# Altium project USB_receiver.PrjPcb
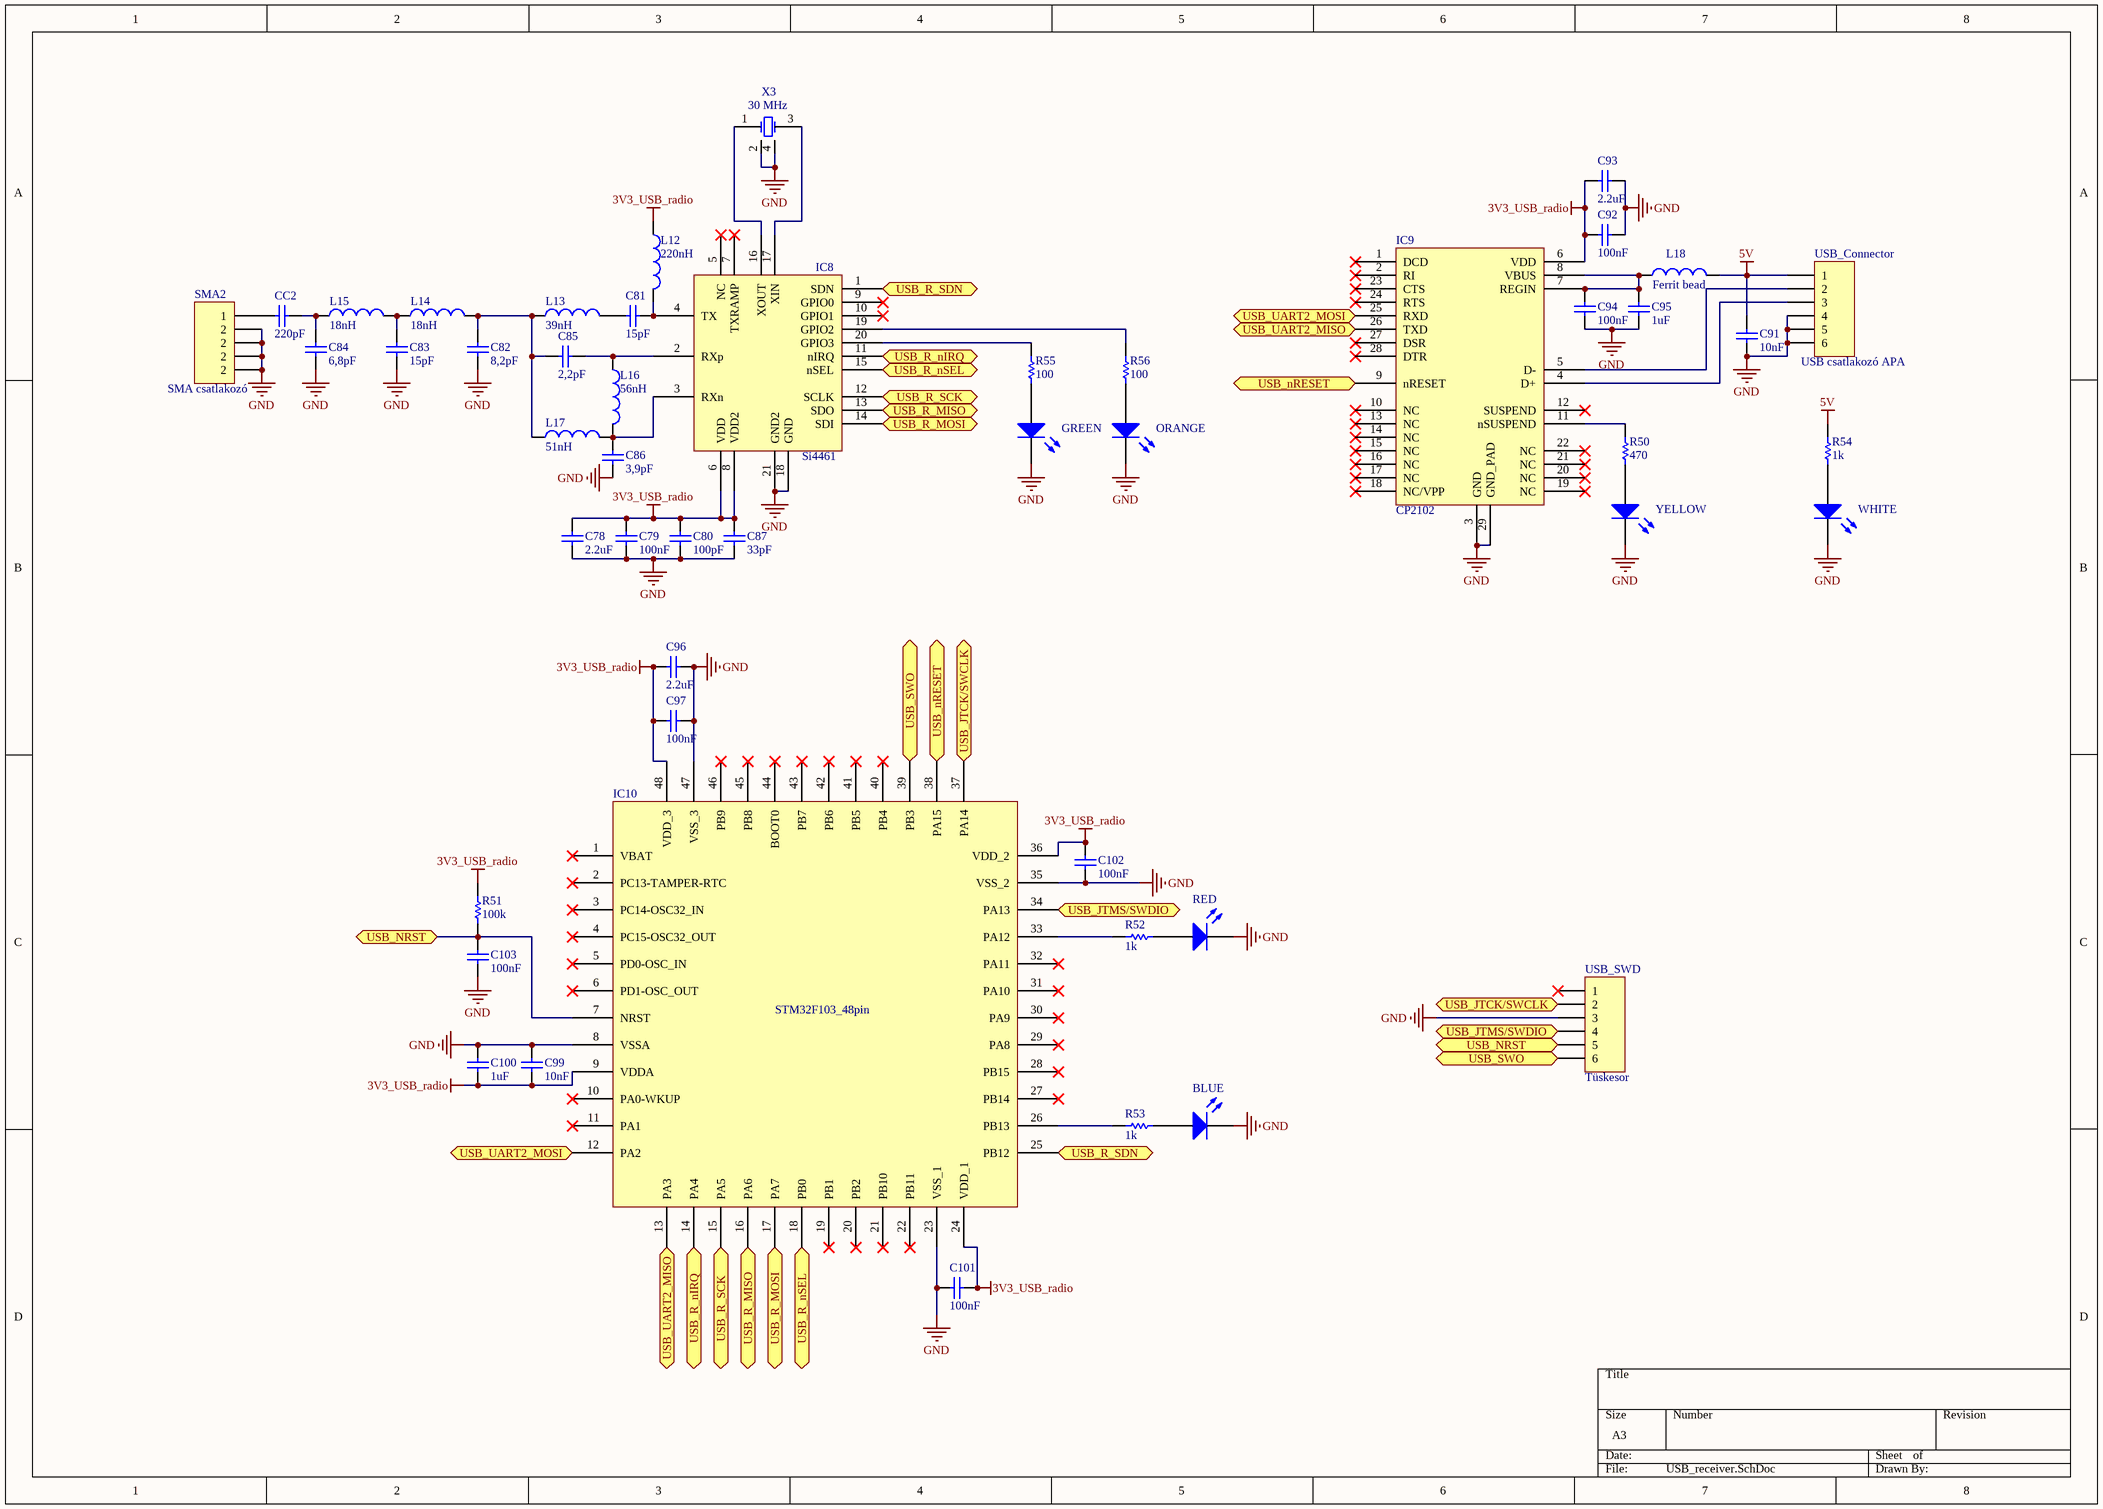
[diagram p0: USB_receiver.SchDoc]
1 sheet, 50 parts. Net scope: flat (ports and power ports of the same name join across sheets).
Board file: USB_receiver.PcbDoc

## Sheet USB_receiver.SchDoc
size A3; PageSetup: Record=PageOptions|CenterHorizontal=True|CenterVertical=True|PrintScale=0.73|XCorrection=1.00|YCorrection=1.00|PrintKind=0|BorderSize=5000000|LeftOffset=0|BottomOffset=0|Orientation=2|PaperLength=1000|PaperWidth=1000|Scale=100|PaperSource=7|PrintQuality=-3|MediaType=1|DitherType=10|PrintScaleMode=1|PaperKind=A4|PaperIndex=9

### Parts
BLUE  RED  [1608[0603]]  (value not drawn)
C78  value 2.2uF  [0402]  (hidden comment: Cap)
C79  value 100nF  [0402]  (hidden comment: Cap)
C80  value 100pF  [0402]  (hidden comment: Cap)
C81  value 15pF  [0402]  (hidden comment: Cap)
C82  value 8,2pF  [0402]  (hidden comment: Cap)
C83  value 15pF  [0402]  (hidden comment: Cap)
C84  value 6,8pF  [0402]  (hidden comment: Cap)
C85  value 2,2pF  [0402]  (hidden comment: Cap)
C86  value 3,9pF  [0402]  (hidden comment: Cap)
C87  value 33pF  [0402]  (hidden comment: Cap)
C91  value 10nF  [0402]  (hidden comment: Cap)
C92  value 100nF  [0402]  (hidden comment: Cap)
C93  value 2.2uF  [0402]  (hidden comment: Cap)
C94  value 100nF  [0402]  (hidden comment: Cap)
C95  value 1uF  [0402]  (hidden comment: Cap)
C96  value 2.2uF  [0402]  (hidden comment: Cap)
C97  value 100nF  [0402]  (hidden comment: Cap)
C99  value 10nF  [0402]  (hidden comment: Cap)
C100  value 1uF  [0402]  (hidden comment: Cap)
C101  value 100nF  [0402]  (hidden comment: Cap)
C102  value 100nF  [0402]  (hidden comment: Cap)
C103  value 100nF  [0402]  (hidden comment: Cap)
CC2  value 220pF  [0402]  (hidden comment: Cap)
GREEN  RED  [1608[0603]]  (value not drawn)
IC8  Si4461  [QFN20_thermal_pad]
IC9  CP2102  [RHD28_M]
IC10  STM32F103_48pin  [LQFP48]
L12  value 220nH  [0402]  (hidden comment: Inductor)
L13  value 39nH  [0402]  (hidden comment: Inductor)
L14  value 18nH  [0402]  (hidden comment: Inductor)
L15  value 18nH  [0402]  (hidden comment: Inductor)
L16  value 56nH  [0402]  (hidden comment: Inductor)
L17  value 51nH  [0402]  (hidden comment: Inductor)
L18  Ferrit bead  [1608[0603]]
ORANGE  RED  [1608[0603]]  (value not drawn)
R50  value 470  [0402]  (hidden comment: Res1)
R51  value 100k  [0402]  (hidden comment: Res1)
R52  value 1k  [0402]  (hidden comment: Res1)
R53  value 1k  [0402]  (hidden comment: Res1)
R54  value 1k  [0402]  (hidden comment: Res1)
R55  value 100  [0402]  (hidden comment: Res1)
R56  value 100  [0402]  (hidden comment: Res1)
RED  RED  [1608[0603]]  (value not drawn)
SMA2  SMA csatlakozó  [SMA_connector]
USB_Connector  USB csatlakozó APA  [USB_APA_SMD]
USB_SWD  Tüskesor  [HDR1X6]
WHITE  RED  [1608[0603]]  (value not drawn)
X3  30 MHz  [crystal_sx2520]
YELLOW  RED  [1608[0603]]  (value not drawn)

### Ports
USB_JTCK/SWCLK (bidir), USB_JTMS/SWDIO (bidir), USB_nRESET (in), USB_nRESET (out), USB_NRST, USB_R_MISO (in), USB_R_MISO (out), USB_R_MOSI (in), USB_R_MOSI (out), USB_R_nIRQ (in), USB_R_nIRQ (out), USB_R_nSEL (in), USB_R_nSEL (out), USB_R_SCK (in), USB_R_SCK (out), USB_R_SDN (in), USB_R_SDN (out), USB_SWO (bidir), USB_UART2_MISO (in), USB_UART2_MISO (out), USB_UART2_MOSI (in), USB_UART2_MOSI (out)

### Nets
3V3_USB_radio: C78.2 C79.2 C80.2 C87.2 C92.1 C93.1 C96.1 C97.1 C99.1 C100.1 C101.1 C102.1 IC8.6(VDD) IC8.8(VDD2) IC9.6(VDD) IC10.9(VDDA) IC10.24(VDD_1) IC10.36(VDD_2) IC10.48(VDD_3) L12.1 R51.1
5V: C91.2 L18.2 R54.2 USB_Connector.1
GND: BLUE.2(K) C78.1 C79.1 C80.1 C82.2 C83.2 C84.2 C86.1 C87.1 C91.1 C92.2 C93.2 C94.1 C95.1 C96.2 C97.2 C99.2 C100.2 C101.2 C102.2 C103.1 GREEN.2(K) IC8.18(GND) IC8.21(GND2) IC9.3(GND) IC9.29(GND_PAD) IC10.8(VSSA) IC10.23(VSS_1) IC10.35(VSS_2) IC10.47(VSS_3) ORANGE.2(K) RED.2(K) SMA2.2 USB_Connector.4 USB_Connector.5 USB_Connector.6 USB_SWD.3 WHITE.2(K) X3.2(OSC2) X3.4 YELLOW.2(K)
NetBLUE_1: BLUE.1(A) R53.1
NetC81_1: C81.1 IC8.4(TX) L12.2
NetC81_2: C81.2 L13.2
NetC82_1: C82.1 C85.1 L13.1 L14.2 L17.1
NetC83_1: C83.1 L14.1 L15.2
NetC84_1: C84.1 CC2.2 L15.1
NetC85_2: C85.2 IC8.2(RXp) L16.1
NetC86_2: C86.2 IC8.3(RXn) L16.2 L17.2
NetC94_2: C94.2 C95.2 IC9.7(REGIN) IC9.8(VBUS) L18.1
NetC103_2: C103.2 IC10.7(NRST) R51.2 USB_SWD.5 ; port USB_NRST
NetCC2_1: CC2.1 SMA2.1
NetGREEN_1: GREEN.1(A) R55.1
NetIC8_1: IC8.1(SDN) IC10.25(PB12) ; port USB_R_SDN
NetIC8_11: IC8.11(nIRQ) IC10.14(PA4) ; port USB_R_nIRQ
NetIC8_12: IC8.12(SCLK) IC10.15(PA5) ; port USB_R_SCK
NetIC8_13: IC8.13(SDO) IC10.16(PA6) ; port USB_R_MISO
NetIC8_14: IC8.14(SDI) IC10.17(PA7) ; port USB_R_MOSI
NetIC8_15: IC8.15(nSEL) IC10.18(PB0) ; port USB_R_nSEL
NetIC8_16: IC8.16(XOUT) X3.1(OSC1)
NetIC8_17: IC8.17(XIN) X3.3
NetIC8_19: IC8.19(GPIO2) R56.2
NetIC8_20: IC8.20(GPIO3) R55.2
NetIC9_4: IC9.4(D+) USB_Connector.3
NetIC9_5: IC9.5(D-) USB_Connector.2
NetIC9_9: IC9.9(nRESET) IC10.38(PA15) ; port USB_nRESET
NetIC9_11: IC9.11(nSUSPEND) R50.2
NetIC9_25: IC9.25(RXD) IC10.12(PA2) ; port USB_UART2_MOSI
NetIC9_26: IC9.26(TXD) IC10.13(PA3) ; port USB_UART2_MISO
NetIC10_26: IC10.26(PB13) R53.2
NetIC10_33: IC10.33(PA12) R52.2
NetIC10_34: IC10.34(PA13) USB_SWD.4 ; port USB_JTMS/SWDIO
NetIC10_37: IC10.37(PA14) USB_SWD.2 ; port USB_JTCK/SWCLK
NetIC10_39: IC10.39(PB3) USB_SWD.6 ; port USB_SWO
NetORANGE_1: ORANGE.1(A) R56.1
NetR50_1: R50.1 YELLOW.1(A)
NetR52_1: R52.1 RED.1(A)
NetR54_1: R54.1 WHITE.1(A)

Not connected (* = marked no-connect by the designer): IC8 5(NC)* 7(TXRAMP)* 9(GPIO0)* 10(GPIO1)*; IC9 1(DCD)* 2(RI)* 10(NC)* 12(SUSPEND)* 13(NC)* 14(NC)* 15(NC)* 16(NC)* 17(NC)* 18(NC/VPP)* 19(NC)* 20(NC)* 21(NC)* 22(NC)* 23(CTS)* 24(RTS)* 27(DSR)* 28(DTR)*; IC10 1(VBAT)* 2(PC13-TAMPER-RTC)* 3(PC14-OSC32_IN)* 4(PC15-OSC32_OUT)* 5(PD0-OSC_IN)* 6(PD1-OSC_OUT)* 10(PA0-WKUP)* 11(PA1)* 19(PB1)* 20(PB2)* 21(PB10)* 22(PB11)* 27(PB14)* 28(PB15)* 29(PA8)* 30(PA9)* 31(PA10)* 32(PA11)* 40(PB4)* 41(PB5)* 42(PB6)* 43(PB7)* 44(BOOT0)* 45(PB8)* 46(PB9)*; USB_SWD 1*

### Library data of the parts
BLUE GREEN ORANGE RED WHITE YELLOW = LED0: Typical INFRARED GaAs LED; Published: 8-Jun-2000; LatestRevisionDate: 08-Jul-2005; LatestRevisionNote: Mech Layer 1 removed.; PackageReference: LED-0; Publisher: Altium Limited; PackageDescription: LED; 2 Leads
C78-C87 C91-C97 C99-C103 CC2 = Cap: Capacitor; Published: 8-Jun-2000; LatestRevisionDate: 17-Jul-2002; LatestRevisionNote: Re-released for DXP Platform.; PackageReference: RAD-0.3; Publisher: Altium Limited; PackageDescription: Radial Cap, Thru-Hole; 2 Leads; 0.3 in Pin Spacing
L12-L17 = Inductor: Code_IEC: 1005; Published: 8-Jun-2000; LatestRevisionDate: 29-May-2009; LatestRevisionNote: IPC-7351 Footprint Added.; PackageReference: 0402-A; Publisher: Altium Limited; PackageDescription: Chip Inductor; Code_JEITA: 0402
L18 = Inductor: Code_IEC: 1005; Value: 600Ohm/100MHz-2A; Published: 8-Jun-2000; LatestRevisionDate: 29-May-2009; LatestRevisionNote: IPC-7351 Footprint Added.; PackageReference: 0402-A; Publisher: Altium Limited; PackageDescription: Chip Inductor; Code_JEITA: 0402
R50-R56 = Res1: Resistor; Published: 8-Jun-2000; LatestRevisionDate: 17-Jul-2002; LatestRevisionNote: Re-released for DXP Platform.; PackageReference: AXIAL-0.3; Publisher: Altium Limited; PackageDescription: Axial Device, Thru-Hole; 2 Leads; 0.3 in Pin Spacing
SMA2 = Header 5: Header, 5-Pin; LatestRevisionDate: 17-Jul-2002; LatestRevisionNote: Re-released for DXP Platform.; Publisher: Altium Limited
USB_Connector USB_SWD = Header 6: Header, 6-Pin; LatestRevisionDate: 17-Jul-2002; LatestRevisionNote: Re-released for DXP Platform.; Publisher: Altium Limited
X3 = XTAL: Crystal Oscillator; Published: 8-Jun-2000; LatestRevisionDate: 17-Jul-2002; LatestRevisionNote: Re-released for DXP Platform.; PackageReference: R38; Publisher: Altium Limited; PackageDescription: Crystal, Thru-Hole; 2 Leads; Body 3.1 x 8.2 mm (Dia.xH)